# Altium schematic sheet LiPOBattery.SchDoc
size A4; SheetNumber: 1; SheetTotal: 1
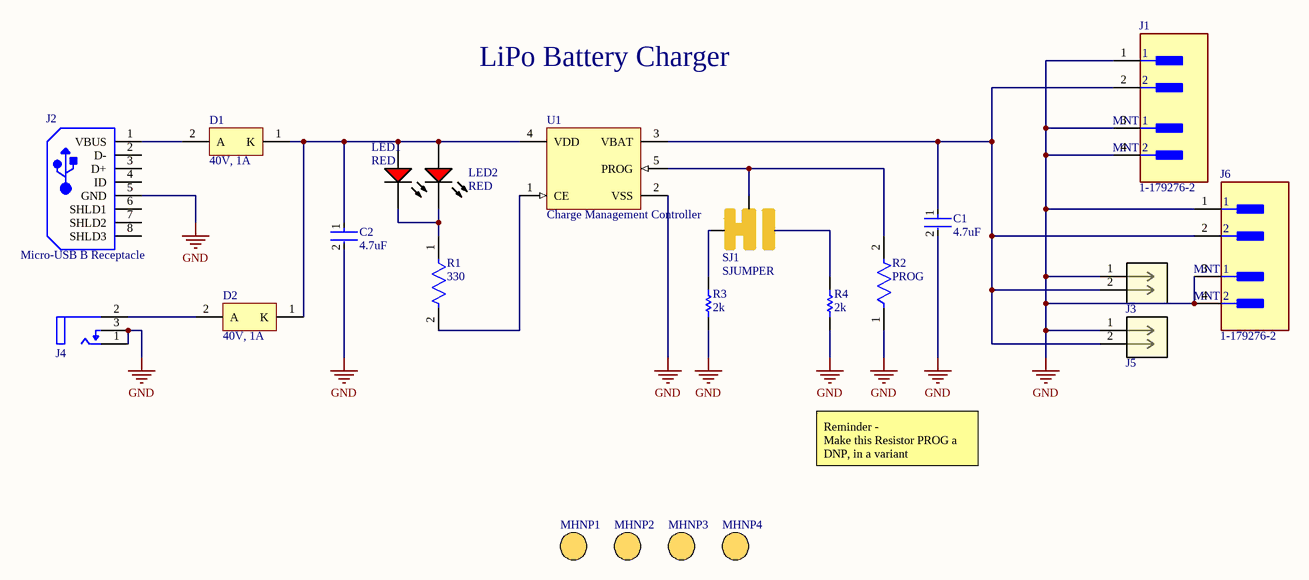
[diagram p0: LiPOBattery.SchDoc]

## Parts
C1  4.7uF  [FP-CC0805-0_85-MFG]
C2  4.7uF  [FP-CC0805-0_85-MFG]
D1  40V, 1A  [ONSC-SMA-2-403D-02_V]
D2  40V, 1A  [ONSC-SMA-2-403D-02_V]
J1  1-179276-2  [FP-1-179276-2-MFG]
J2  Micro-USB B Receptacle  [MOLX-105133-0001_V]
J3  2 POS VERT HEADER 0.001  [2Pins_AMP]  (value not drawn)
J4  CONN PWR JACK 2.1X5.5MM SOLDER  [FP-RASM722PTR13X-MFG]  (value not drawn)
J5  2 POS VERT HEADER 0.001  [2Pins_AMP]  (value not drawn)
J6  1-179276-2  [FP-1-179276-2-MFG]
LED1  RED  [VISH-TLMS1000_V]
LED2  RED  [VISH-TLMS1000_V]
MHNP1  Mounting Hole Non Plated 3.2mm  [MTHNP3P2MM]  (value not drawn)
MHNP2  Mounting Hole Non Plated 3.2mm  [MTHNP3P2MM]  (value not drawn)
MHNP3  Mounting Hole Non Plated 3.2mm  [MTHNP3P2MM]  (value not drawn)
MHNP4  Mounting Hole Non Plated 3.2mm  [MTHNP3P2MM]  (value not drawn)
R1  330  [FP-CRCW0805-e3-MFG]
R2  PROG  [FP-RS02B-MFG]
R3  2k  [RESC2013X70X40ML20T20]
R4  2k  [RESC2013X70X40ML20T20]
SJ1  SJUMPER  [SJUMPER-Footprint-1]
U1  Charge Management Controller  [SOT-23-OT5_M]

## Nets
GND: C1.2 C2.2 J1.1 J1.3(MNT_1) J1.4(MNT_2) J2.5(GND) J3.1 J4.1(TIP_TERMINAL(CENTER_PIN)) J4.3(SHUNT_TERMINAL) J5.1 J6.1 J6.3(MNT_1) J6.4(MNT_2) R2.1 R3.1 R4.1 U1.2(VSS)
NetC1_1: C1.1 J1.2 J3.2 J5.2 J6.2 U1.3(VBAT)
NetC2_1: C2.1 D1.1(K) D2.1(K) LED1.1(A) LED2.1(A) U1.4(VDD)
NetD1_2: D1.2(A) J2.1(VBUS)
NetD2_2: D2.2(A) J4.2(SLEEVE_TERMINAL)
NetLED1_2: LED1.2(K) LED2.2(K) R1.1
NetR1_2: R1.2 U1.1(CE)
NetR2_2: R2.2 SJ1.2 U1.5(PROG)
NetR3_2: R3.2 SJ1.1
NetR4_2: R4.2 SJ1.3

Not connected (* = marked no-connect by the designer): J2 2(D-) 3(D+) 4(ID) 6(SHLD1) 7(SHLD2) 8(SHLD3)

## Notes on the sheet
- LiPo Battery Charger
- Reminder -
  Make this Resistor PROG a DNP, in a variant

## Library data of the parts
C1 C2 = CMP-03422-001342-1: CAP CER 4.7UF 6.3V X7R 0805; Manufacturer: Yageo; Manufacturer Part Number: CC0805KKX7R5BB475; Tolerance: 0.1; Material: Ceramic; Automotive: No; Temperature Characteristic: X7R; Package: CC0805-0.85; Value: 4.7 uF; Capacitance: 4.7 uF; Voltage Rating: 6.3 V; Octopart: https://octopart.com/cc0805kkx7r5bb475-yageo-27548069; Category: Cap; Digikey Description: CAP CER 4.7UF 6.3V X7R 0805; Device Class L3: Ceramic Capacitors; Temperature: -30°C to +85°C; ComponentLink2URL: http://www.yageo.com/documents/recent/UPY-GPHC_Y5V_6.3V-to-50V_8.pdf; Mouser Description: Multilayer Ceramic Capacitors MLCC - SMD/SMT 4.7uF 6.3V X7R 10%; Temperature Range High: +85°C; RoHS: TRUE; Device Class L2: Capacitors; ComponentLink2Description: Datasheet; Height: 0.95mm; Device Class L1: Passive Components; Ipc Land Pattern Name: CAPC200125X85; Lead Free: Yes; Temperature Range Low: -30°C; Footprint Url: http://www.yageo.com/exep/pages/download/literatures/UPY-C_GEN_24.pdf
D1 D2 = CMP-1055-00320-1: Schottky Power Rectifier, 2-Pin SMA, Pb-Free, Tape and Reel; PartNumber: MBRA140T3G; Manufacturer: On Semiconductor; Configuration: Single; IFSM Max (A): 30; PackageReference: SMA-2-403D-02; PackageDescription: 2-Pin Small Molded Package, J-Bend Lead, Body 2.605 x 4.315 mm; RoHS: TRUE; ComponentLink1Description: Manufacturer URL; Packing: Tape and Reel; ComponentLink3URL: http://www.onsemi.com/pub_link/Collateral/403D-02.PDF; ComponentLink2Description: Datasheet; ComponentLink2URL: http://www.onsemi.cn/pub_link/Collateral/MBRA140T3-D.PDF; DatasheetVersion: Rev. 10; ComponentLink1URL: http://www.onsemi.com/; ComponentLink3Description: Package Specification; Mounting Technology: Surface Mount; PackageVersion: Rev. G, 07/2012
J1 J6 = CMP-03369-000124-1: CONN HEADER R/A 2POS 5.08MM; Preloaded: Yes; Mating Retention: Yes (With); PCB Mounting Orientation: Right Angle; PCB Mount Retention: With; Approvals: UL; Voltage Rating: 600V; PCB Mount Alignment: No (Without); Shielding: Unshielded; Tail Length: 3.8mm; Pitch: 0.2inch; Number of Terminals/Pins: 2; VDE Tested: No; Contact Current Rating: 15A; PCB Thickness: 0.063inch; Number of Ports: 1; Connector System: Wire-to-Board; Connector Type: Plug; REACH SVHC: No SVHC; Depth: 22.1mm; Mount: Through Hole; Radiation Hardening: No; Lead Free: Lead Free; Series: Dynamic 3200; ELV: Compliant; Max Voltage Rating (AC): 600V; Housing Material: Polyester; Height: 0.368inch; Packaging: Tray; Shrouded: Yes (With); Contact Material: Copper Alloy; Mating Alignment: Yes (With); Sealable: No (Without); Contact Retention: No (Without); Color: Black; Strain Relief: No (Without); Min Operating Temperature: -67°C; Orientation: Right Angle; Halogen Free: Halogen Free; Housing Color: Black; Number of Contacts: 2; Package Quantity: 26; Length: 0.751inch; RoHS Compliant: Yes; Contact Type: Male Pin; Selectively Loaded: No (Without); Termination: Solder; Max Operating Temperature: 221°C; Contact Plating: Gold; Number of Positions: 2; Flammability Rating: UL94 V-0; Number of Rows: 1; Width: 22.1mm; Contact Gender: Male
J2 = CMP-2000-05829-1: Micro-USB B Receptacle, Vertical, -30 to 85 degC, 5-Pin SMD, RoHS, Tape and Reel; Manufacturer: Molex; PartNumber: 105133-0001; Package Version: Rev. C, 11/2015; Voltage Rating: 30VAC; Connector Type: MicroUSBTypeBReceptacle; Current Rating: 1.8A; Number of Ports: 1; Voltage - Max: 30V; Mounting Style: SMD/SMT; Packaging: Reel; Product: MicroUSBTypeBConnectors; Contact Plating: Gold; Flammability Rating: UL94V-0; Package Description: 5-Pin Surface Mount Device, Pitch 0.65 mm; Package Reference: 105133-0001; Contact Material: CopperAlloy; Mounting Angle: Vertical; RoHS: Details; Manufacturer URL: http://www.molex.com/; Factory Pack Quantity: 6000; Standard: USB; Brand: Molex; Series: 105133; Product Category: USBConnectors; Termination Style: SolderTail; Gender: Receptacle; Package URL: http://www.molex.com/pdm_docs/sd/1051330001_sd.pdf; Datasheet Version: 03/2016; Color: Black; Datasheet URL: http://www.molex.com/webdocs/datasheets/pdf/en-us/1051330001_IO_CONNECTORS.pdf; Mounting Technology: SurfaceMount
J3 J5 = 67997-402HLF: Description; Manufacturer_Name: Amphenol ICC; Copyright: Copyright (C) 2025 Ultra Librarian. All rights reserved.; Manufacturer_Part_Number: 67997-402HLF; RefDes: RefDes; Type: Type; Supplier 1: DigiKey; Supplier Part Number 1: 609-5502-ND
J4 = CMP-47995-000002-1: Shielding: Unshielded; Gender: Male; Current Rating: 5A; Termination: Solder; Contact Material: Copper Alloy; Package Quantity: 120; Case/Package: SMD/SMT; Contact Plating: Tin; Connector Type: Jack; Housing Material: Thermoplastic; Mount: Surface Mount; Housing Color: Black; Color: Black
LED1 LED2 = CMP-2000-07254-1: Low Current LED, 40 mW, 1.8 V, -40 to 100 degC, 2-Pin SMD (0603), RoHS, Tape and Reel; Manufacturer: Vishay; Lens Shape: Rectangular; Automotive Qualification Standard: AEC-Q100; Wavelength Typ: 636nm; SVHC: ToBeAdvised; Bulb Size: 1.6mmx0.8mm; Forward Voltage: 1.8V; Luminous Intensity: 4mcd; Forward Current If: 2mA; Viewing Angle: 80°; Datasheet Version: Rev. 1.7, 02/2011; Datasheet URL: https://datasheet.ciiva.com/5798/1698881-5798337.pdf; LED Mounting: SMD; Packaging: CutTape; Package Reference: TLMS1000; Manufacturer URL: http://www.vishay.com/; Mounting Technology: SurfaceMount; Product Range: -; LED Colour: Red; Package Description: 2-Pin Surface Mount Device, Body 1.6 x 0.8 mm; MSL: MSL2-1year
MHNP1-MHNP4 = MTHNP3P2MM: Mounting Hole Non Plated 3.2mm drill hole
R1 = CMP-2001-03823-2: RES Thick Film, 330Ω, 1%, 0.125W, 100ppm/°C, 0805; Voltage Rating (DC): 150V; Resistance: 330R; Max Power Dissipation: 125mW; Mount: Surface Mount; Packaging: Tape and Reel; Min Operating Temperature: -55°C; Military Standard: Not; Case Code (Metric): 2012; Height: 0.02inch; Voltage Rating: 150V; Case/Package: 0805; Max Operating Temperature: 155°C; Width: 0.049inch; Case Code (Imperial): 0805; Termination: SMD/SMT; Lead Free: Lead Free; Contact Plating: Tin; Package Quantity: 10; Composition: Thick Film; Length: 2mm; Features: Automotive AEC-Q200; Depth: 1.25mm; Weight: 0.000194oz; Tolerance: 1%; Power Rating: 125mW; Number of Terminations: 2; Temperature Coefficient: 100ppm/°C
R2 = CMP-02408-000037-1: Res Wirewound 12K Ohm 1% 3W ±20ppm/°C Ceramic Hi Temp Sil AXL Thru-Hole Bulk; Resistance: 12kR; Lead Diameter: 0.81mm; Resistor Type: Wirewound; Case/Package: Ceramic; Contact Plating: Tin; Diameter: 4.75mm; Length: 14.22mm; Min Operating Temperature: -65°C; Lead Free: Lead Free; Tolerance: 1%; Power Rating: 3W; Termination: Axial; RoHS Compliant: Yes; Series: RS; Package Quantity: 100; Width: 4.75mm; Temperature Coefficient: 20ppm/°C; Mount: Through Hole; Weight: 0.024692oz; Max Operating Temperature: 250°C
R3 R4 = CMP-2001-00370-1: Part Number: ERJ-6GEYJ202V; Manufacturer: Panasonic
SJ1 = CMP-00030-00002-1: Solder jumper pad
U1 = CMP-0133-00139-1: Simple, Miniature Single-Cell, Fully Integrated Li-Ion/Li-Polymer Charge Management Controller, 4.2V, 5-Pin SOT-23, Industrial Temperature, Tape and Reel; Code_IPC: SOT23-5; PackageDescription: 5-Lead Plastic Small Outline Transistor (OT) [SOT-23]; PackageVersion: revBB, Aug-2009; DatasheetVersion: revB, Sep-2007; PackageReference: SOT-23-OT5